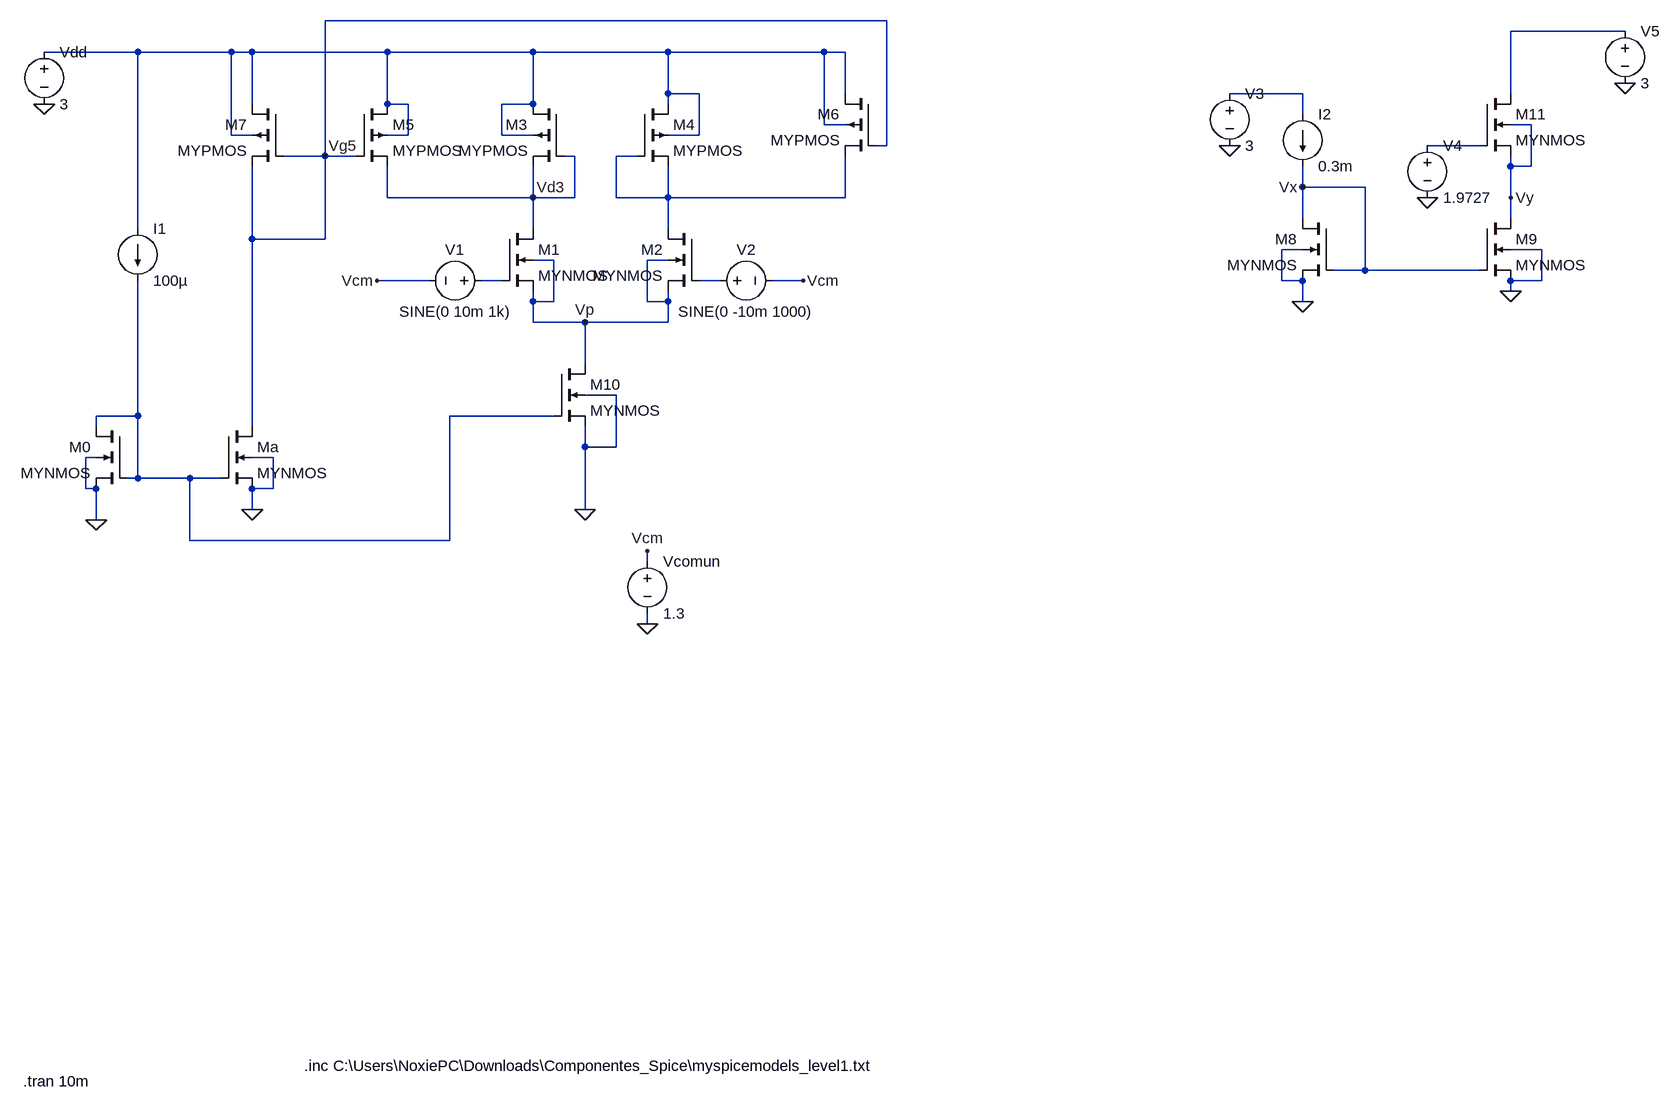
[diagram p0: schematic week5prueba.asc]
week5prueba.asc, the LTspice schematic file:
Version 4.1
SHEET 1 2264 680
WIRE 1072 -1504 208 -1504
WIRE 2208 -1488 2032 -1488
WIRE -80 -1456 -224 -1456
WIRE 64 -1456 -80 -1456
WIRE 96 -1456 64 -1456
WIRE 304 -1456 96 -1456
WIRE 528 -1456 304 -1456
WIRE 736 -1456 528 -1456
WIRE 976 -1456 736 -1456
WIRE 1008 -1456 976 -1456
WIRE 736 -1392 736 -1456
WIRE 784 -1392 736 -1392
WIRE 1008 -1392 1008 -1456
WIRE 1712 -1392 1600 -1392
WIRE 2032 -1392 2032 -1488
WIRE 96 -1376 96 -1456
WIRE 304 -1376 304 -1456
WIRE 336 -1376 304 -1376
WIRE 528 -1376 528 -1456
WIRE 528 -1376 480 -1376
WIRE 736 -1376 736 -1392
WIRE 1712 -1360 1712 -1392
WIRE 976 -1344 976 -1456
WIRE 1008 -1344 976 -1344
WIRE 2064 -1344 2032 -1344
WIRE 64 -1328 64 -1456
WIRE 96 -1328 64 -1328
WIRE 336 -1328 336 -1376
WIRE 336 -1328 304 -1328
WIRE 480 -1328 480 -1376
WIRE 528 -1328 480 -1328
WIRE 784 -1328 784 -1392
WIRE 784 -1328 736 -1328
WIRE 1072 -1312 1072 -1504
WIRE 1072 -1312 1056 -1312
WIRE 1984 -1312 1904 -1312
WIRE 208 -1296 208 -1504
WIRE 208 -1296 144 -1296
WIRE 256 -1296 208 -1296
WIRE 592 -1296 576 -1296
WIRE 688 -1296 656 -1296
WIRE 2032 -1280 2032 -1296
WIRE 2064 -1280 2064 -1344
WIRE 2064 -1280 2032 -1280
WIRE 1712 -1248 1712 -1280
WIRE 1808 -1248 1712 -1248
WIRE 304 -1232 304 -1280
WIRE 528 -1232 528 -1280
WIRE 528 -1232 304 -1232
WIRE 592 -1232 592 -1296
WIRE 592 -1232 528 -1232
WIRE 656 -1232 656 -1296
WIRE 736 -1232 736 -1280
WIRE 736 -1232 656 -1232
WIRE 1008 -1232 1008 -1296
WIRE 1008 -1232 736 -1232
WIRE 2032 -1232 2032 -1280
WIRE 1712 -1200 1712 -1248
WIRE 2032 -1200 2032 -1232
WIRE -80 -1184 -80 -1456
WIRE 528 -1184 528 -1232
WIRE 736 -1184 736 -1232
WIRE 96 -1168 96 -1280
WIRE 208 -1168 208 -1296
WIRE 208 -1168 96 -1168
WIRE 1712 -1152 1680 -1152
WIRE 2080 -1152 2032 -1152
WIRE 560 -1136 528 -1136
WIRE 736 -1136 704 -1136
WIRE 1808 -1120 1808 -1248
WIRE 1808 -1120 1760 -1120
WIRE 1984 -1120 1808 -1120
WIRE 368 -1104 288 -1104
WIRE 480 -1104 448 -1104
WIRE 816 -1104 784 -1104
WIRE 944 -1104 896 -1104
WIRE 1680 -1104 1680 -1152
WIRE 1712 -1104 1680 -1104
WIRE 2080 -1104 2080 -1152
WIRE 2080 -1104 2032 -1104
WIRE 2032 -1088 2032 -1104
WIRE 528 -1072 528 -1088
WIRE 560 -1072 560 -1136
WIRE 560 -1072 528 -1072
WIRE 704 -1072 704 -1136
WIRE 736 -1072 736 -1088
WIRE 736 -1072 704 -1072
WIRE 1712 -1072 1712 -1104
WIRE 528 -1040 528 -1072
WIRE 608 -1040 528 -1040
WIRE 736 -1040 736 -1072
WIRE 736 -1040 608 -1040
WIRE 608 -976 608 -1040
WIRE 656 -928 608 -928
WIRE -80 -896 -80 -1104
WIRE -80 -896 -144 -896
WIRE 560 -896 400 -896
WIRE -144 -880 -144 -896
WIRE 96 -880 96 -1168
WIRE 608 -848 608 -880
WIRE 656 -848 656 -928
WIRE 656 -848 608 -848
WIRE -144 -832 -160 -832
WIRE 128 -832 96 -832
WIRE -80 -800 -80 -896
WIRE -80 -800 -96 -800
WIRE 0 -800 -80 -800
WIRE 48 -800 0 -800
WIRE -160 -784 -160 -832
WIRE -144 -784 -160 -784
WIRE 128 -784 128 -832
WIRE 128 -784 96 -784
WIRE 96 -752 96 -784
WIRE 608 -752 608 -848
WIRE -144 -736 -144 -784
WIRE 0 -704 0 -800
WIRE 400 -704 400 -896
WIRE 400 -704 0 -704
WIRE 704 -672 704 -688
WIRE 704 -576 704 -592
FLAG -224 -1376 0
FLAG -144 -736 0
FLAG 608 -1040 Vp
FLAG 288 -1104 Vcm
FLAG 704 -576 0
FLAG 704 -688 Vcm
FLAG 944 -1104 Vcm
FLAG 608 -752 0
FLAG 96 -752 0
FLAG 208 -1296 Vg5
FLAG 528 -1232 Vd3
FLAG 1600 -1312 0
FLAG 1712 -1072 0
FLAG 2032 -1088 0
FLAG 2032 -1232 Vy
FLAG 1712 -1248 Vx
FLAG 1904 -1232 0
FLAG 2208 -1408 0
SYMBOL voltage -224 -1472 R0
WINDOW 123 0 0 Left 0
WINDOW 39 0 0 Left 0
SYMATTR InstName Vdd
SYMATTR Value 3
SYMBOL nmos4 -96 -880 M0
SYMATTR InstName M0
SYMATTR Value MYNMOS
SYMATTR Value2 l=0.5 w=10
SYMBOL nmos4 48 -880 R0
SYMATTR InstName Ma
SYMATTR Value MYNMOS
SYMATTR Value2 l=0.5 w=20
SYMBOL nmos4 560 -976 R0
SYMATTR InstName M10
SYMATTR Value MYNMOS
SYMATTR Value2 l=0.5 w=50
SYMBOL nmos4 480 -1184 R0
SYMATTR InstName M1
SYMATTR Value MYNMOS
SYMATTR Value2 l=0.5 w=46.3
SYMBOL voltage 704 -688 R0
WINDOW 123 0 0 Left 0
WINDOW 39 0 0 Left 0
SYMATTR InstName Vcomun
SYMATTR Value 1.3
SYMBOL nmos4 784 -1184 M0
SYMATTR InstName M2
SYMATTR Value MYNMOS
SYMATTR Value2 l=0.5 w=46.3
SYMBOL pmos4 576 -1376 M0
SYMATTR InstName M3
SYMATTR Value MYPMOS
SYMATTR Value2 l=0.5 w=10
SYMBOL pmos4 688 -1376 R0
SYMATTR InstName M4
SYMATTR Value MYPMOS
SYMATTR Value2 l=0.5 w=10
SYMBOL pmos4 1056 -1392 M0
SYMATTR InstName M6
SYMATTR Value MYPMOS
SYMATTR Value2 l=0.5 w=10
SYMBOL pmos4 256 -1376 R0
SYMATTR InstName M5
SYMATTR Value MYPMOS
SYMATTR Value2 l=0.5 w=10
SYMBOL pmos4 144 -1376 M0
SYMATTR InstName M7
SYMATTR Value MYPMOS
SYMATTR Value2 l=0.5 w=10
SYMBOL current -80 -1184 R0
WINDOW 123 0 0 Left 0
WINDOW 39 0 0 Left 0
SYMATTR InstName I1
SYMATTR Value 100µ
SYMBOL voltage 464 -1104 R90
WINDOW 0 -32 56 VBottom 2
WINDOW 3 32 56 VTop 2
WINDOW 123 0 0 Left 0
WINDOW 39 0 0 Left 0
SYMATTR InstName V1
SYMATTR Value SINE(0 10m 1k)
SYMBOL voltage 800 -1104 R270
WINDOW 0 32 56 VTop 2
WINDOW 3 -32 56 VBottom 2
WINDOW 123 0 0 Left 0
WINDOW 39 0 0 Left 0
SYMATTR InstName V2
SYMATTR Value SINE(0 -10m 1000)
SYMBOL voltage 1600 -1408 R0
WINDOW 123 0 0 Left 0
WINDOW 39 0 0 Left 0
SYMATTR InstName V3
SYMATTR Value 3
SYMBOL nmos4 1760 -1200 M0
SYMATTR InstName M8
SYMATTR Value MYNMOS
SYMATTR Value2 l=0.5 w=40
SYMBOL current 1712 -1360 R0
WINDOW 123 0 0 Left 0
WINDOW 39 0 0 Left 0
SYMATTR InstName I2
SYMATTR Value 0.3m
SYMBOL nmos4 1984 -1200 R0
SYMATTR InstName M9
SYMATTR Value MYNMOS
SYMATTR Value2 l=0.5 w=40
SYMBOL nmos4 1984 -1392 R0
SYMATTR InstName M11
SYMATTR Value MYNMOS
SYMATTR Value2 l=0.5 w=40
SYMBOL voltage 1904 -1328 R0
WINDOW 123 0 0 Left 0
WINDOW 39 0 0 Left 0
SYMATTR InstName V4
SYMATTR Value 1.9727
SYMBOL voltage 2208 -1504 R0
WINDOW 123 0 0 Left 0
WINDOW 39 0 0 Left 0
SYMATTR InstName V5
SYMATTR Value 3
TEXT 176 104 Left 2 !.inc C:\\Users\\NoxiePC\\Downloads\\Componentes_Spice\\myspicemodels_level1.txt
TEXT -256 128 Left 2 !.tran 10m

The netlist it stands for:
* week5prueba.asc
Vdd N002 0 3
M0 N008 N008 0 0 MYNMOS l=0.5 w=10
Ma Vg5 N008 0 0 MYNMOS l=0.5 w=20
M10 Vp N008 0 0 MYNMOS l=0.5 w=50
M1 Vd3 N006 Vp Vp MYNMOS l=0.5 w=46.3
Vcomun Vcm 0 1.3
M2 N005 N007 Vp Vp MYNMOS l=0.5 w=46.3
M3 N002 Vd3 Vd3 N002 MYPMOS l=0.5 w=10
M4 N002 N005 N005 N002 MYPMOS l=0.5 w=10
M6 N002 Vg5 N005 N002 MYPMOS l=0.5 w=10
M5 N002 Vg5 Vd3 N002 MYPMOS l=0.5 w=10
M7 N002 Vg5 Vg5 N002 MYPMOS l=0.5 w=10
I1 N002 N008 100µ
V1 N006 Vcm SINE(0 10m 1k)
V2 N007 Vcm SINE(0 -10m 1000)
V3 N003 0 3
M8 Vx Vx 0 0 MYNMOS l=0.5 w=40
I2 N003 Vx 0.3m
M9 Vy Vx 0 0 MYNMOS l=0.5 w=40
M11 N001 N004 Vy Vy MYNMOS l=0.5 w=40
V4 N004 0 1.9727
V5 N001 0 3
.model NMOS NMOS
.model PMOS PMOS
.lib standard.mos
.inc C:\Users\NoxiePC\Downloads\Componentes_Spice\myspicemodels_level1.txt
.tran 10m
.backanno
.end